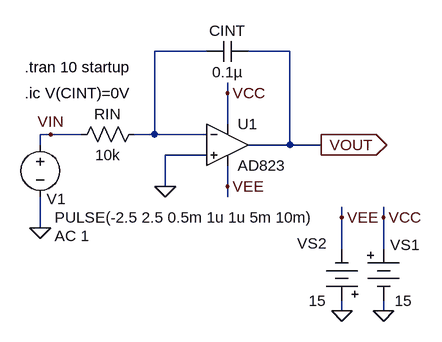
[diagram p0: schematic fig-01-03-23.asc]
fig-01-03-23.asc, the LTspice schematic file:
Version 4
SHEET 1 880 680
WIRE 176 32 96 32
WIRE 304 32 240 32
WIRE 208 96 208 80
WIRE 208 144 208 96
WIRE -64 160 -80 160
WIRE -16 160 -64 160
WIRE 96 160 96 32
WIRE 96 160 64 160
WIRE 176 160 96 160
WIRE -80 176 -80 160
WIRE 304 176 304 32
WIRE 304 176 240 176
WIRE 352 176 304 176
WIRE 176 192 112 192
WIRE 112 240 112 192
WIRE 208 240 208 208
WIRE 208 256 208 240
WIRE 384 288 384 272
WIRE 448 288 448 272
WIRE -80 304 -80 256
WIRE 384 336 384 288
WIRE 448 336 448 288
WIRE 384 432 384 416
WIRE 448 432 448 416
FLAG -80 304 0
FLAG -64 160 VIN
FLAG 384 432 0
FLAG 448 432 0
FLAG 384 288 VEE
FLAG 448 288 VCC
FLAG 208 96 VCC
FLAG 208 240 VEE
FLAG 352 176 VOUT
IOPIN 352 176 Out
FLAG 112 240 0
SYMBOL voltage -80 160 R0
WINDOW 0 10 99 Left 2
WINDOW 3 22 128 Left 2
WINDOW 123 22 156 Left 2
WINDOW 39 0 0 Left 0
SYMATTR InstName V1
SYMATTR Value PULSE(-2.5 2.5 0.5m 1u 1u 5m 10m)
SYMATTR Value2 AC 1
SYMBOL Misc\\battery 448 320 R0
WINDOW 0 10 10 Left 2
WINDOW 3 17 96 Left 2
SYMATTR InstName VS1
SYMATTR Value 15
SYMBOL Misc\\battery 384 432 R180
WINDOW 0 24 104 Left 2
WINDOW 3 24 16 Left 2
SYMATTR InstName VS2
SYMATTR Value 15
SYMBOL res 80 144 R90
WINDOW 0 0 56 VBottom 2
WINDOW 3 32 56 VTop 2
SYMATTR InstName RIN
SYMATTR Value 10k
SYMBOL cap 240 16 R90
WINDOW 0 0 32 VBottom 2
WINDOW 3 32 32 VTop 2
SYMATTR InstName CINT
SYMATTR Value 0.1µ
SYMBOL Opamps\\AD823 208 112 R0
SYMATTR InstName U1
TEXT -104 56 Left 2 !.tran 10 startup
TEXT -104 96 Left 2 !.ic V(CINT)=0V

The netlist it stands for:
* fig-01-03-23.asc
V1 VIN 0 PULSE(-2.5 2.5 0.5m 1u 1u 5m 10m) AC 1
VS1 VCC 0 15
VS2 0 VEE 15
RIN N001 VIN 10k
CINT VOUT N001 0.1µ
XU1 0 N001 VCC VEE VOUT AD823  ; pins In+ In- V+ V- OUT
.tran 10 startup
.ic V(CINT)=0V
.lib ADI.lib
.backanno
.end